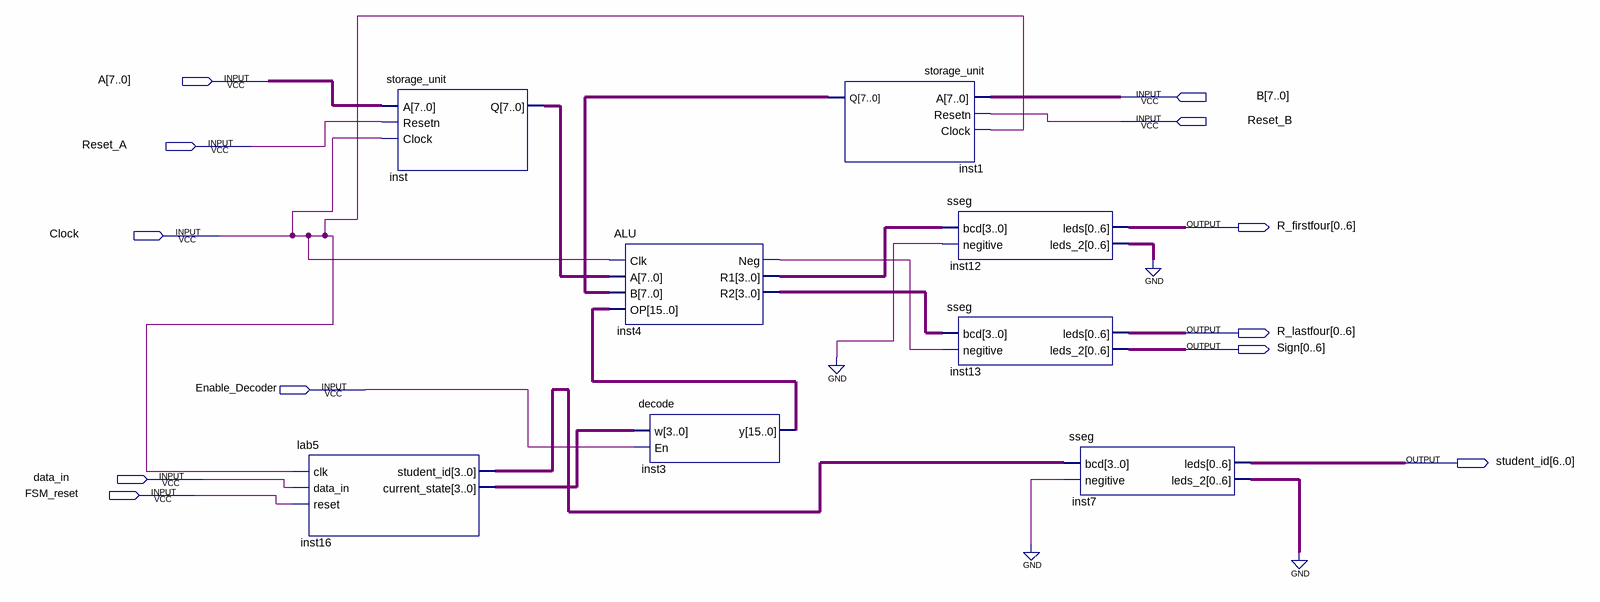
[diagram p0: schematic sheet]
// Quartus schematic ALU1.bdf as structural Verilog: 8 symbols, 12 pins
module ALU1 (
  input  [7:0] A,
  input  [7:0] B,
  input  Reset_B,
  input  Reset_A,
  input  Clock,
  input  Enable_Decoder,
  input  data_in,
  input  FSM_reset,
  output [0:6] R_firstfour,
  output [0:6] R_lastfour,
  output [0:6] Sign,
  output [6:0] student_id
);

  wire inst4_neg;
  wire [3:0] inst4_r1, inst4_r2, inst16_current_state, inst16_student_id;
  wire [6:0] inst7_leds_2, inst12_leds_2;
  wire [7:0] inst1_q, inst_q;
  wire [15:0] inst3_y;

  lab5 inst16 (
    .clk(Clock), .data_in(data_in), .reset(FSM_reset), .student_id(inst16_student_id),
    .current_state(inst16_current_state));
  storage_unit inst (.A(A), .Resetn(Reset_A), .Clock(Clock), .Q(inst_q));
  ALU inst4 (.Clk(Clock), .A(inst_q), .B(inst1_q), .OP(inst3_y), .Neg(inst4_neg), .R1(inst4_r1), .R2(inst4_r2));
  decode inst3 (.w(inst16_current_state), .En(Enable_Decoder), .y(inst3_y));
  storage_unit inst1 (.A(B), .Resetn(Reset_B), .Clock(Clock), .Q(inst1_q));
  sseg inst12 (.bcd(inst4_r1), .negitive(1'b0), .leds(R_firstfour), .leds_2(inst12_leds_2));
  sseg inst13 (.bcd(inst4_r2), .negitive(inst4_neg), .leds(R_lastfour), .leds_2(Sign));
  sseg inst7 (.bcd(inst16_student_id), .negitive(1'b0), .leds(student_id), .leds_2(inst7_leds_2));
  // also tied to GND on the sheet: {inst7_leds_2[0], inst7_leds_2[1], inst7_leds_2[2], inst7_leds_2[3], inst7_leds_2[4], inst7_leds_2[5], inst7_leds_2[6], inst12_leds_2[0], inst12_leds_2[1], inst12_leds_2[2], inst12_leds_2[3], inst12_leds_2[4], inst12_leds_2[5], inst12_leds_2[6]}
endmodule
